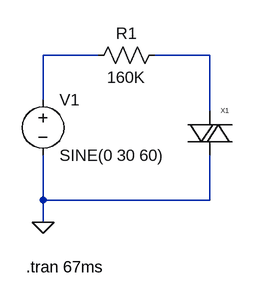
[diagram p0: schematic diac_test.asc]
diac_test.asc, the LTspice schematic file:
Version 4
SHEET 1 880 680
WIRE 224 64 144 64
WIRE 384 64 304 64
WIRE 144 128 144 64
WIRE 384 144 384 64
WIRE 144 272 144 208
WIRE 384 272 384 208
WIRE 384 272 144 272
WIRE 144 304 144 272
FLAG 144 304 0
SYMBOL voltage 144 112 R0
SYMATTR InstName V1
SYMATTR Value SINE(0 30 60)
SYMBOL res 320 48 R90
WINDOW 0 0 56 VBottom 2
WINDOW 3 32 56 VTop 2
SYMATTR InstName R1
SYMATTR Value 160K
SYMBOL DIAC 352 144 R0
SYMATTR InstName X1
TEXT 120 368 Left 2 !.tran 67ms

The netlist it stands for:
* diac_test.asc
V1 N001 0 SINE(0 30 60)
R1 N002 N001 160K
XX1 N002 0 DIAC  ; pins + -
.tran 67ms
.lib DIAC.lib
.backanno
.end